# Altium schematic sheet Power.SchDoc
size A4
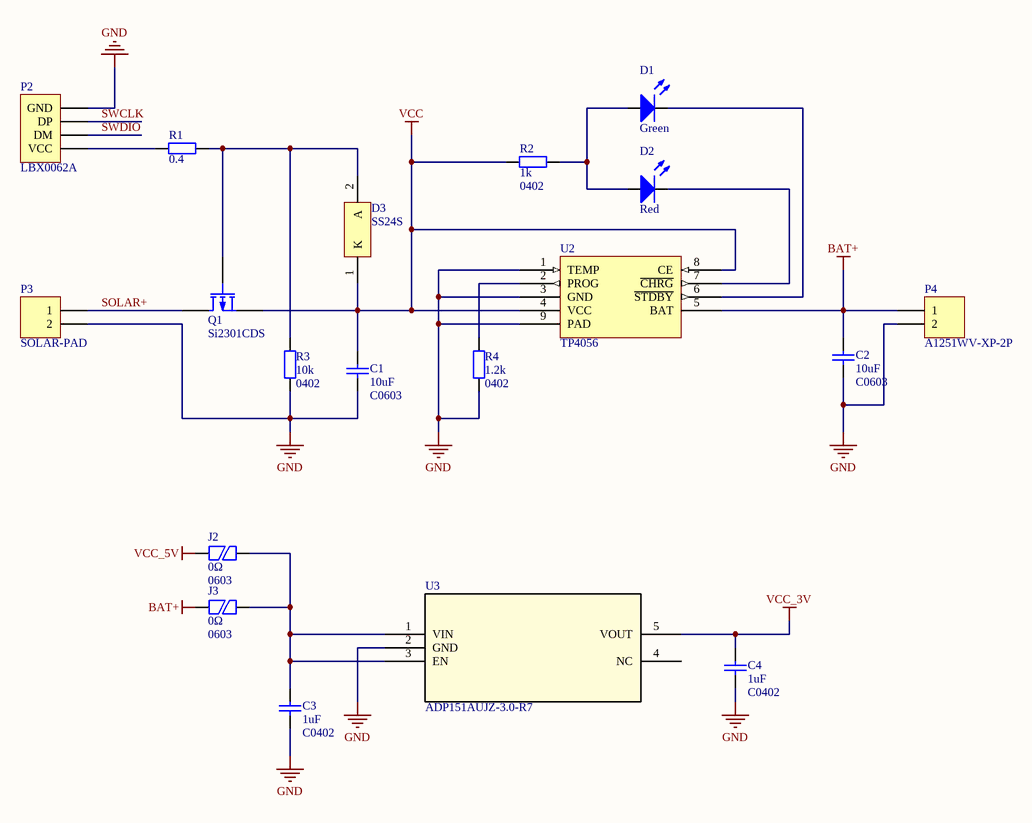
[diagram p0: Power.SchDoc]

## Parts
C1  10uF  PackageReference: C0603  [1608[0603]]
C2  10uF  PackageReference: C0603  [1608[0603]]
C3  1uF  PackageReference: C0402  [0402]
C4  1uF  PackageReference: C0402  [0402]
D1  Green  [0603/K]
D2  Red  [0603/K]
D3  SS24S  [ONSC-SMA-2-403D-02_V]
J2  0Ω  PackageReference: 0603  [1608[0603] - jumper]
J3  0Ω  PackageReference: 0603  [1608[0603] - jumper]
P2  LBX0062A  [LBX0062A]
P3  SOLAR-PAD  [SOLAR-PAD]
P4  A1251WV-XP-2P  [A1251WV-XP-2P]
Q1  Si2301CDS  [SOT95P237X112-3N]
R1  0.4  [RESC3216X07N]
R2  1k  PackageReference: 0402  [RESC1005X04N]
R3  10k  PackageReference: 0402  [RESC1005X04N]
R4  1.2k  PackageReference: 0402  [RESC1005X04N]
U2  TP4056  [ESOP-9N]
U3  ADP151AUJZ-3.0-R7  [UJ_5]

## Nets
BAT+: C2.2 J3.1 P4.1 U2.5(BAT)
GND: C1.1 C2.1 C3.1 C4.1 P2.4(GND) P3.2 P4.2 R3.1 R4.1 U2.1(TEMP) U2.3(GND) U2.9(PAD) U3.2(GND)
VCC: C1.2 D3.1(K) Q1.2(S) R2.1 U2.4(VCC) U2.8(CE)
VCC_3V: C4.2 U3.5(VOUT)
VCC_5V: J2.1
SOLAR+: P3.1 Q1.3(D)
SWCLK: P2.3(DP)
SWDIO: P2.2(DM)
NetC3_2: C3.2 J2.2 J3.2 U3.1(VIN) U3.3(EN)
NetD1_A: D1.A D2.A R2.2
NetD1_K: D1.K U2.6(~{STDBY})
NetD2_K: D2.K U2.7(~{CHRG})
NetD3_2: D3.2(A) Q1.1(G) R1.2 R3.2
NetP2_1: P2.1(VCC) R1.1
NetR4_2: R4.2 U2.2(PROG)

Not connected (* = marked no-connect by the designer): U3 4(NC)

## Library data of the parts
C1 C2 = C1608X5R1A106K080AC: Capacitor (0603,X5R,10uF,DC 10V,±10%) TDK; Published: 8-Jun-2000; LatestRevisionDate: 29-May-2009; LatestRevisionNote: IPC-7351 Footprint Added.; Publisher: Altium Limited; PackageDescription: Chip Capacitor; Value: 10uF
C3 C4 = C1005X5R1E105K050BC: Capacitor (0402,X5R,1uF,DC 25V,±10%) TDK; Published: 8-Jun-2000; LatestRevisionDate: 29-May-2009; LatestRevisionNote: IPC-7351 Footprint Added.; Publisher: Altium Limited; PackageDescription: Chip Capacitor; Value: 1uF
D1 = TLMG1100-GS08: Standard 0603 SMD LED, Green, 2.1V,-40 °C to +100 °C; Published: 8-Jun-2000; LatestRevisionDate: 17-Jul-2002; LatestRevisionNote: Re-released for DXP Platform.; PackageVersion: Feb-2002; PackageReference: 0603; Publisher: Altium Limited; PackageDescription: SM LED; 2 Flat Leads; Valid: Green
D2 = TLMS1100-GS08: Standard 0603 SMD LED, Red, 2.1V,-40 °C to +100 °C; Published: 8-Jun-2000; LatestRevisionDate: 17-Jul-2002; LatestRevisionNote: Re-released for DXP Platform.; PackageVersion: Feb-2002; PackageReference: 0603; Publisher: Altium Limited; PackageDescription: SM LED; 2 Flat Leads; Valid: Red
D3 = SS24S: Schottky Power Rectifier, 2-Pin SMA, VRRM=40V , VF=0.517V at IF=2.0A , Pb-Free, Tape and Reel; Manufacturer: On Semiconductor; Configuration: Single; IFSM Max (A): 40; DatasheetVersion: Rev. 7; PackageVersion: Rev. G, 07/2012; PackageReference: SMA-2-403D-02; PackageDescription: 2-Pin Small Molded Package, J-Bend Lead, Body 2.605 x 4.315 mm; Supplier 1: Digi-Key; Supplier Part Number 1: SS16T3GOSTR-ND; Supplier 2: Digi-Key; Supplier Part Number 2: SS16T3GOSCT-ND; Supplier 3: Digi-Key; Supplier Part Number 3: SS16T3GOSDKR-ND; Supplier 4: Farnell; Supplier Part Number 4: 2317421; Supplier 5: Farnell; Supplier Part Number 5: 1900107; Supplier 6: Newark; Supplier Part Number 6: 98H0976; Supplier 7: Newark; Supplier Part Number 7: 10N9613; Supplier 8: Mouser; Supplier Part Number 8: 863-SS16T3G; Packing: Tape and Reel; RoHS: TRUE; Mounting Technology: Surface Mount; PartNumber: SS24S; ComponentLink1Description: Manufacturer URL; ComponentLink1URL: http://www.onsemi.com/; ComponentLink2Description: Datasheet; ComponentLink2URL: http://www.onsemi.cn/pub_link/Collateral/SS16-D.PDF; ComponentLink3Description: Package Specification; ComponentLink3URL: http://www.onsemi.com/pub_link/Collateral/403D-02.PDF
J2 J3 = JUMP-0603: jumper 0603(1608); PackageDescription: Chip Resistor, 2-Leads, Body 1.60x0.80mm, IPC Medium Density; Value: 0Ω
P2 = LBX0062A: PogoPinLBX0062A, 4-Pin; LatestRevisionDate: 17-Jul-2002; LatestRevisionNote: Re-released for DXP Platform.; Publisher: Altium Limited
P3 = SOLAR-PAD: Header, 2-Pin; LatestRevisionDate: 17-Jul-2002; LatestRevisionNote: Re-released for DXP Platform.; Publisher: Altium Limited
P4 = A1251WV-XP-2P: Header, 2-Pin; LatestRevisionDate: 17-Jul-2002; LatestRevisionNote: Re-released for DXP Platform.; Publisher: Altium Limited
Q1 = Si2301CDS: P-Channel MOSFET,VDS=-20V,VGS=8V,ID=3.1A,VGS(th)Min=0.4V,SOT-23; Published: 8-Jun-2000; LatestRevisionDate: 17-Jul-2002; LatestRevisionNote: Re-released for DXP Platform.; PackageVersion: 1995/1996; PackageReference: SOT23; Publisher: Altium Limited; PackageDescription: SOT23, 3-Leads, Body 2.92x2.37mm, Pitch 0.95mm, IPC Medium Density
R1 = PE1206FRF470R4L: Resistor 1206(3216) 0.4Ω ±1% 1W AUTOMOTIVE GRADEPE_L series; PackageReference: 1206; PackageDescription: Chip Resistor, 2-Leads, Body 3.20x1.60mm, IPC Medium Density; Value: 0.4
R2 = RC0402FR-071KL: Resistor 0402(1005) 1kΩ ±1%; PackageDescription: Chip Resistor, 2-Leads, Body 1.00x0.50mm, IPC Medium Density; Value: 1k
R3 = RC0402FR-0710KL: Resistor 0402(1005) 10kΩ ±1%; PackageDescription: Chip Resistor, 2-Leads, Body 1.00x0.50mm, IPC Medium Density; Value: 10k
R4 = RC0402FR-071K2L: Resistor 0402(1005) 1.2kΩ ±1%; PackageDescription: Chip Resistor, 2-Leads, Body 1.00x0.50mm, IPC Medium Density; Value: 1.2k
U2 = TP4056: 1A线性锂离子电池充电器
U3 = ADP151: The ADP151 is an ultralow noise, low dropout (LDO) linear regulator that operates from 2.2 V to 5.5 V and provides up to 200 mA of output current.; Dropout Voltage(mV): 140; RMS Niose(uV): 9; Isupply(uA): 10; Vin(V): 2.2-5.5; Iout(max)(mA): 200; Vout(V): 1.1, 1.2, 1.5, 1.8, 2.1, 2.5, 2.6, 2.75, 2.8, 2.85, 3.0, 3.3